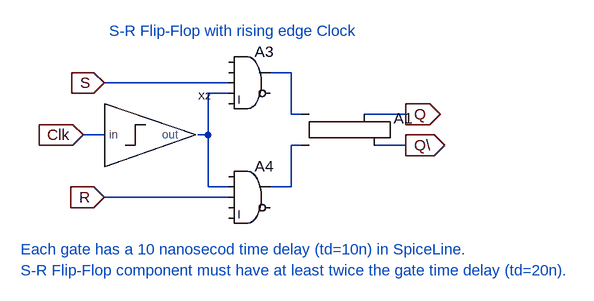
[diagram p0: schematic d50705a.asc]
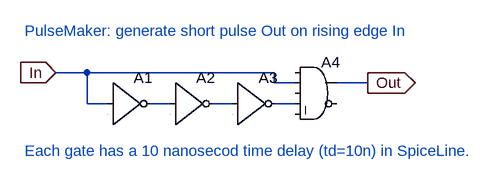
[diagram p1: sub-circuit d50705b.asc]
d50705a.asc, the LTspice schematic file:
Version 4
SHEET 1 1096 680
WIRE -96 80 -128 80
WIRE -192 96 -384 96
WIRE -192 112 -224 112
WIRE -96 144 -96 80
WIRE -80 144 -96 144
WIRE 80 144 16 144
WIRE -384 176 -416 176
WIRE -224 176 -224 112
WIRE -224 176 -240 176
WIRE -80 192 -96 192
WIRE 80 192 32 192
WIRE -224 256 -224 176
WIRE -192 256 -224 256
WIRE -96 256 -96 192
WIRE -96 256 -128 256
WIRE -192 272 -384 272
FLAG -384 272 R
IOPIN -384 272 In
FLAG -384 96 S
IOPIN -384 96 In
FLAG 80 144 Q
IOPIN 80 144 Out
FLAG 80 192 Q\
IOPIN 80 192 Out
FLAG -416 176 Clk
IOPIN -416 176 In
SYMBOL Digital\\and -160 32 R0
SYMATTR InstName A3
SYMATTR SpiceLine td=10n
SYMBOL Digital\\and -160 208 R0
SYMATTR InstName A4
SYMATTR SpiceLine td=10n
SYMBOL Digital\\srflop -32 96 R0
SYMATTR InstName A1
SYMATTR SpiceLine Trise=10nS td=20n
SYMBOL d50705b -320 176 R0
SYMATTR InstName X2
TEXT -512 352 Left 0 ;Each gate has a 10 nanosecod time delay (td=10n) in SpiceLine.
TEXT -376 16 Left 0 ;S-R Flip-Flop with rising edge Clock
TEXT -512 384 Left 0 ;S-R Flip-Flop component must have at least twice the gate time delay (td=20n).

d50705b.asc, the sub-circuit schematic file:
Version 4
SHEET 1 880 680
WIRE 16 144 -32 144
WIRE 304 144 16 144
WIRE 304 160 304 144
WIRE 336 160 304 160
WIRE 448 160 400 160
WIRE 16 192 16 144
WIRE 48 192 16 192
WIRE 144 192 112 192
WIRE 240 192 208 192
WIRE 336 192 304 192
FLAG -32 144 In
IOPIN -32 144 In
FLAG 448 160 Out
IOPIN 448 160 Out
SYMBOL Digital\\inv 48 128 R0
SYMATTR InstName A1
SYMATTR SpiceLine td=10n
SYMBOL Digital\\inv 144 128 R0
SYMATTR InstName A2
SYMATTR SpiceLine td=10n
SYMBOL Digital\\inv 240 128 R0
SYMATTR InstName A3
SYMATTR SpiceLine td=10n
SYMBOL Digital\\and 368 112 R0
SYMATTR InstName A4
SYMATTR SpiceLine td=10n
TEXT -80 264 Left 0 ;Each gate has a 10 nanosecod time delay (td=10n) in SpiceLine.
TEXT -80 80 Left 0 ;PulseMaker: generate short pulse Out on rising edge In

The netlist it stands for:
* d50705a.asc
A3 0 0 S N002 0 0 N001 0 AND td=10n
A4 0 N002 R 0 0 0 N003 0 AND td=10n
A1 N001 N003 0 0 0 Q\ Q 0 SRFLOP Trise=10nS td=20n
XX2 Clk N002 d50705b

* block symbol definitions
.subckt d50705b in out
A1 In 0 0 0 0 N001 0 0 BUF td=10n
A2 N001 0 0 0 0 N002 0 0 BUF td=10n
A3 N002 0 0 0 0 N003 0 0 BUF td=10n
A4 0 In 0 N003 0 0 Out 0 AND td=10n
* Each gate has a 10 nanosecod time delay (td=10n) in SpiceLine.
* PulseMaker: generate short pulse Out on rising edge In
.ends d50705b

* Each gate has a 10 nanosecod time delay (td=10n) in SpiceLine.
* S-R Flip-Flop with rising edge Clock
* S-R Flip-Flop component must have at least twice the gate time delay (td=20n).
.backanno
.end